# Altium schematic sheet Diagram.SchDoc
size 431 x 279 mm
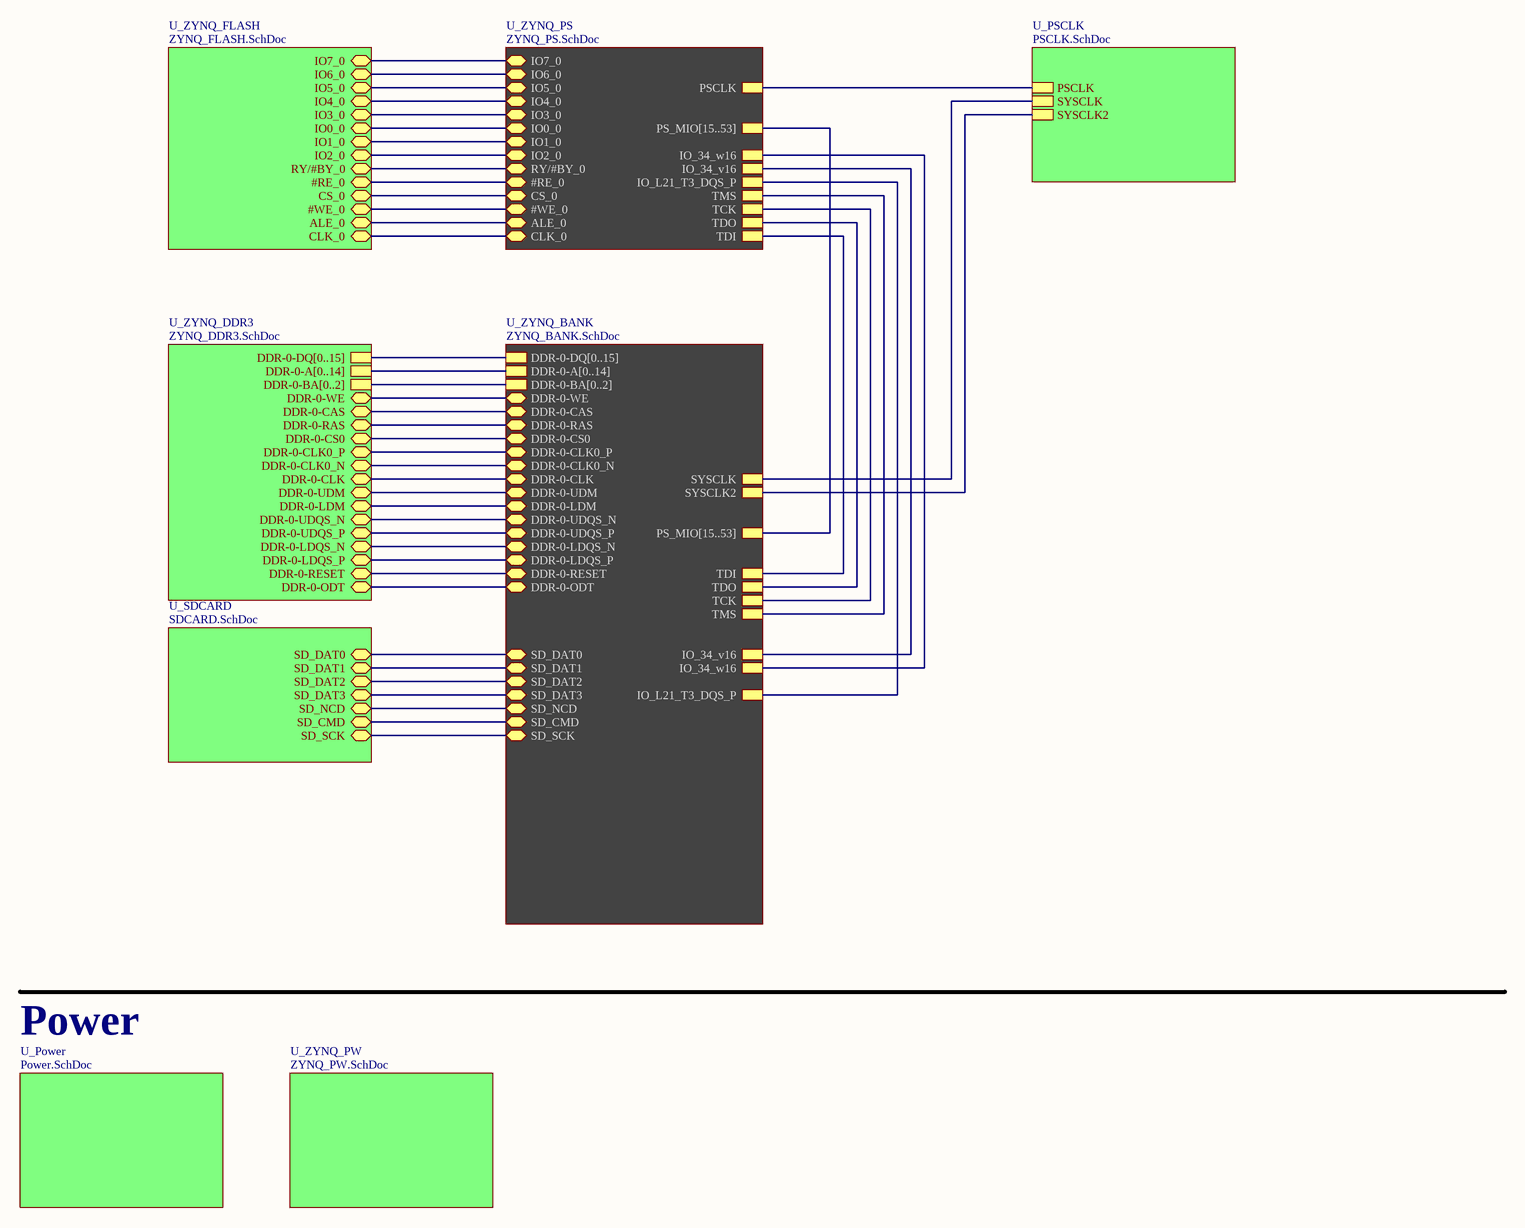
[diagram p0: Diagram.SchDoc]

## Sub-sheets
U_Power = Power.SchDoc: no entries
U_PSCLK = PSCLK.SchDoc: PSCLK, SYSCLK, SYSCLK2
U_SDCARD = SDCARD.SchDoc: SD_DAT0 (bidir), SD_DAT1 (bidir), SD_DAT2 (bidir), SD_DAT3 (bidir), SD_NCD (bidir), SD_CMD (bidir), SD_SCK (bidir)
U_ZYNQ_BANK = ZYNQ_BANK.SchDoc: DDR-0-DQ[0..15], DDR-0-A[0..14], DDR-0-BA[0..2], DDR-0-WE (bidir), DDR-0-CAS (bidir), DDR-0-RAS (bidir), DDR-0-CS0 (bidir), DDR-0-CLK0_P (bidir), DDR-0-CLK0_N (bidir), DDR-0-CLK (bidir), DDR-0-UDM (bidir), DDR-0-LDM (bidir), DDR-0-UDQS_N (bidir), DDR-0-UDQS_P (bidir), DDR-0-LDQS_N (bidir), DDR-0-LDQS_P (bidir), DDR-0-RESET (bidir), DDR-0-ODT (bidir), SD_CMD (bidir), SD_DAT0 (bidir), SD_SCK (bidir), SD_DAT1 (bidir), SD_DAT2 (bidir), SD_DAT3 (bidir), SD_NCD (bidir), SYSCLK, SYSCLK2, PS_MIO[15..53], TDI, TDO, TCK, TMS, IO_34_v16, IO_34_w16, IO_L21_T3_DQS_P
U_ZYNQ_DDR3 = ZYNQ_DDR3.SchDoc: DDR-0-DQ[0..15], DDR-0-A[0..14], DDR-0-BA[0..2], DDR-0-WE (bidir), DDR-0-CAS (bidir), DDR-0-RAS (bidir), DDR-0-CS0 (bidir), DDR-0-CLK0_P (bidir), DDR-0-CLK0_N (bidir), DDR-0-CLK (bidir), DDR-0-UDM (bidir), DDR-0-LDM (bidir), DDR-0-UDQS_N (bidir), DDR-0-UDQS_P (bidir), DDR-0-LDQS_N (bidir), DDR-0-LDQS_P (bidir), DDR-0-RESET (bidir), DDR-0-ODT (bidir)
U_ZYNQ_FLASH = ZYNQ_FLASH.SchDoc: IO7_0 (bidir), IO6_0 (bidir), IO5_0 (bidir), IO4_0 (bidir), IO3_0 (bidir), IO0_0 (bidir), IO1_0 (bidir), IO2_0 (bidir), RY/#BY_0 (bidir), #RE_0 (bidir), CS_0 (bidir), #WE_0 (bidir), ALE_0 (bidir), CLK_0 (bidir)
U_ZYNQ_PS = ZYNQ_PS.SchDoc: IO7_0 (bidir), IO6_0 (bidir), IO5_0 (bidir), IO4_0 (bidir), IO3_0 (bidir), IO0_0 (bidir), IO1_0 (bidir), IO2_0 (bidir), RY/#BY_0 (bidir), #RE_0 (bidir), CS_0 (bidir), #WE_0 (bidir), ALE_0 (bidir), CLK_0 (bidir), PSCLK, PS_MIO[15..53], TDI, TDO, TCK, TMS, IO_34_v16, IO_34_w16, IO_L21_T3_DQS_P
U_ZYNQ_PW = ZYNQ_PW.SchDoc: no entries

## Nets
(unnamed): sheet U_ZYNQ_PS/IO7_0, sheet U_ZYNQ_FLASH/IO7_0
(unnamed): sheet U_ZYNQ_PS/IO6_0, sheet U_ZYNQ_FLASH/IO6_0
(unnamed): sheet U_ZYNQ_PS/IO5_0, sheet U_ZYNQ_FLASH/IO5_0
(unnamed): sheet U_ZYNQ_PS/IO4_0, sheet U_ZYNQ_FLASH/IO4_0
(unnamed): sheet U_ZYNQ_PS/IO3_0, sheet U_ZYNQ_FLASH/IO3_0
(unnamed): sheet U_ZYNQ_PS/IO0_0, sheet U_ZYNQ_FLASH/IO0_0
(unnamed): sheet U_ZYNQ_PS/IO1_0, sheet U_ZYNQ_FLASH/IO1_0
(unnamed): sheet U_ZYNQ_PS/IO2_0, sheet U_ZYNQ_FLASH/IO2_0
(unnamed): sheet U_ZYNQ_PS/RY/#BY_0, sheet U_ZYNQ_FLASH/RY/#BY_0
(unnamed): sheet U_ZYNQ_PS/#RE_0, sheet U_ZYNQ_FLASH/#RE_0
(unnamed): sheet U_ZYNQ_PS/CS_0, sheet U_ZYNQ_FLASH/CS_0
(unnamed): sheet U_ZYNQ_PS/#WE_0, sheet U_ZYNQ_FLASH/#WE_0
(unnamed): sheet U_ZYNQ_PS/ALE_0, sheet U_ZYNQ_FLASH/ALE_0
(unnamed): sheet U_ZYNQ_PS/CLK_0, sheet U_ZYNQ_FLASH/CLK_0
(unnamed): sheet U_ZYNQ_PS/PSCLK, sheet U_PSCLK/PSCLK
(unnamed): sheet U_ZYNQ_PS/TDI, sheet U_ZYNQ_BANK/TDI
(unnamed): sheet U_ZYNQ_PS/TDO, sheet U_ZYNQ_BANK/TDO
(unnamed): sheet U_ZYNQ_PS/TCK, sheet U_ZYNQ_BANK/TCK
(unnamed): sheet U_ZYNQ_PS/TMS, sheet U_ZYNQ_BANK/TMS
(unnamed): sheet U_ZYNQ_PS/IO_34_v16, sheet U_ZYNQ_BANK/IO_34_v16
(unnamed): sheet U_ZYNQ_PS/IO_34_w16, sheet U_ZYNQ_BANK/IO_34_w16
(unnamed): sheet U_ZYNQ_PS/IO_L21_T3_DQS_P, sheet U_ZYNQ_BANK/IO_L21_T3_DQS_P
(unnamed): sheet U_ZYNQ_BANK/DDR-0-WE, sheet U_ZYNQ_DDR3/DDR-0-WE
(unnamed): sheet U_ZYNQ_BANK/DDR-0-CAS, sheet U_ZYNQ_DDR3/DDR-0-CAS
(unnamed): sheet U_ZYNQ_BANK/DDR-0-RAS, sheet U_ZYNQ_DDR3/DDR-0-RAS
(unnamed): sheet U_ZYNQ_BANK/DDR-0-CS0, sheet U_ZYNQ_DDR3/DDR-0-CS0
(unnamed): sheet U_ZYNQ_BANK/DDR-0-CLK0_P, sheet U_ZYNQ_DDR3/DDR-0-CLK0_P
(unnamed): sheet U_ZYNQ_BANK/DDR-0-CLK0_N, sheet U_ZYNQ_DDR3/DDR-0-CLK0_N
(unnamed): sheet U_ZYNQ_BANK/DDR-0-CLK, sheet U_ZYNQ_DDR3/DDR-0-CLK
(unnamed): sheet U_ZYNQ_BANK/DDR-0-UDM, sheet U_ZYNQ_DDR3/DDR-0-UDM
(unnamed): sheet U_ZYNQ_BANK/DDR-0-LDM, sheet U_ZYNQ_DDR3/DDR-0-LDM
(unnamed): sheet U_ZYNQ_BANK/DDR-0-UDQS_N, sheet U_ZYNQ_DDR3/DDR-0-UDQS_N
(unnamed): sheet U_ZYNQ_BANK/DDR-0-UDQS_P, sheet U_ZYNQ_DDR3/DDR-0-UDQS_P
(unnamed): sheet U_ZYNQ_BANK/DDR-0-LDQS_N, sheet U_ZYNQ_DDR3/DDR-0-LDQS_N
(unnamed): sheet U_ZYNQ_BANK/DDR-0-LDQS_P, sheet U_ZYNQ_DDR3/DDR-0-LDQS_P
(unnamed): sheet U_ZYNQ_BANK/DDR-0-RESET, sheet U_ZYNQ_DDR3/DDR-0-RESET
(unnamed): sheet U_ZYNQ_BANK/DDR-0-ODT, sheet U_ZYNQ_DDR3/DDR-0-ODT
(unnamed): sheet U_ZYNQ_BANK/SD_CMD, sheet U_SDCARD/SD_CMD
(unnamed): sheet U_ZYNQ_BANK/SD_DAT0, sheet U_SDCARD/SD_DAT0
(unnamed): sheet U_ZYNQ_BANK/SD_SCK, sheet U_SDCARD/SD_SCK
(unnamed): sheet U_ZYNQ_BANK/SD_DAT1, sheet U_SDCARD/SD_DAT1
(unnamed): sheet U_ZYNQ_BANK/SD_DAT2, sheet U_SDCARD/SD_DAT2
(unnamed): sheet U_ZYNQ_BANK/SD_DAT3, sheet U_SDCARD/SD_DAT3
(unnamed): sheet U_ZYNQ_BANK/SD_NCD, sheet U_SDCARD/SD_NCD
(unnamed): sheet U_ZYNQ_BANK/SYSCLK, sheet U_PSCLK/SYSCLK
(unnamed): sheet U_ZYNQ_BANK/SYSCLK2, sheet U_PSCLK/SYSCLK2

## Buses and harness runs
bus sheet U_ZYNQ_BANK/DDR-0-A[0..14] = sheet U_ZYNQ_DDR3/DDR-0-A[0..14]
bus sheet U_ZYNQ_BANK/DDR-0-BA[0..2] = sheet U_ZYNQ_DDR3/DDR-0-BA[0..2]
bus sheet U_ZYNQ_BANK/DDR-0-DQ[0..15] = sheet U_ZYNQ_DDR3/DDR-0-DQ[0..15]
bus sheet U_ZYNQ_BANK/PS_MIO[15..53] = sheet U_ZYNQ_PS/PS_MIO[15..53]

## Notes on the sheet
- Power
- DWG. NO.
- REV.
- SHT.
- THIS DOCUMENT AND THE DATA DISCLOSED HEREIN OR HEREWITH IS THE PROPERTY OF ALTIUM LIMITED AND MAY BE FREELY DISTRIBUTED IN WHOLE. NO RIGHTS ARE RESERVED OR EXPRESS OR IMPLIED WARANTEE GIVEN.
- REVISION
- DESCRIPTION
- DATE
- APPROVED
- ENG:
- APPROVALS
- PROJECT
- DSN:
- CHK:
- REFERENCE DOCUMENTS
- PROJECT REVISION:
- TITLE
- DOCUMENT REVISION:
- DESIGN ITEM:
- BOM:
- FAB DWG:
- PCB DWG:
- ASSY DWG:
- SCALE:
- SIZE
- B
- CAGE CODE
- FILE NAME
- DWG NO.
- SHEET
- OF
- REV